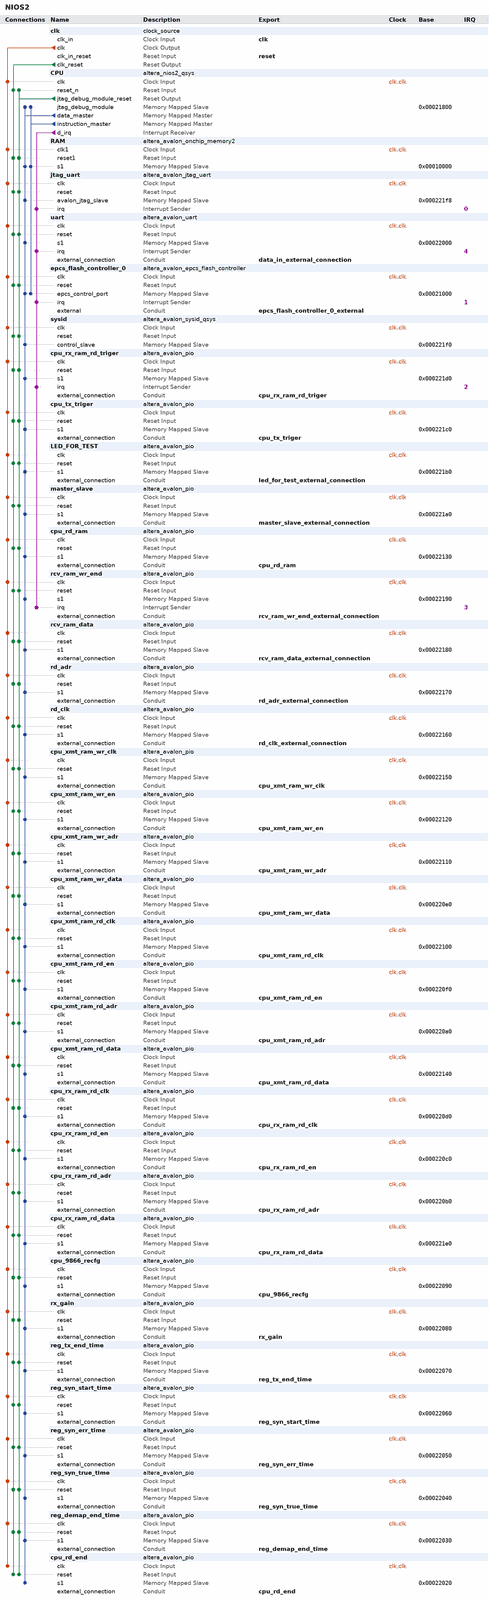
[diagram p0: system contents, whole]
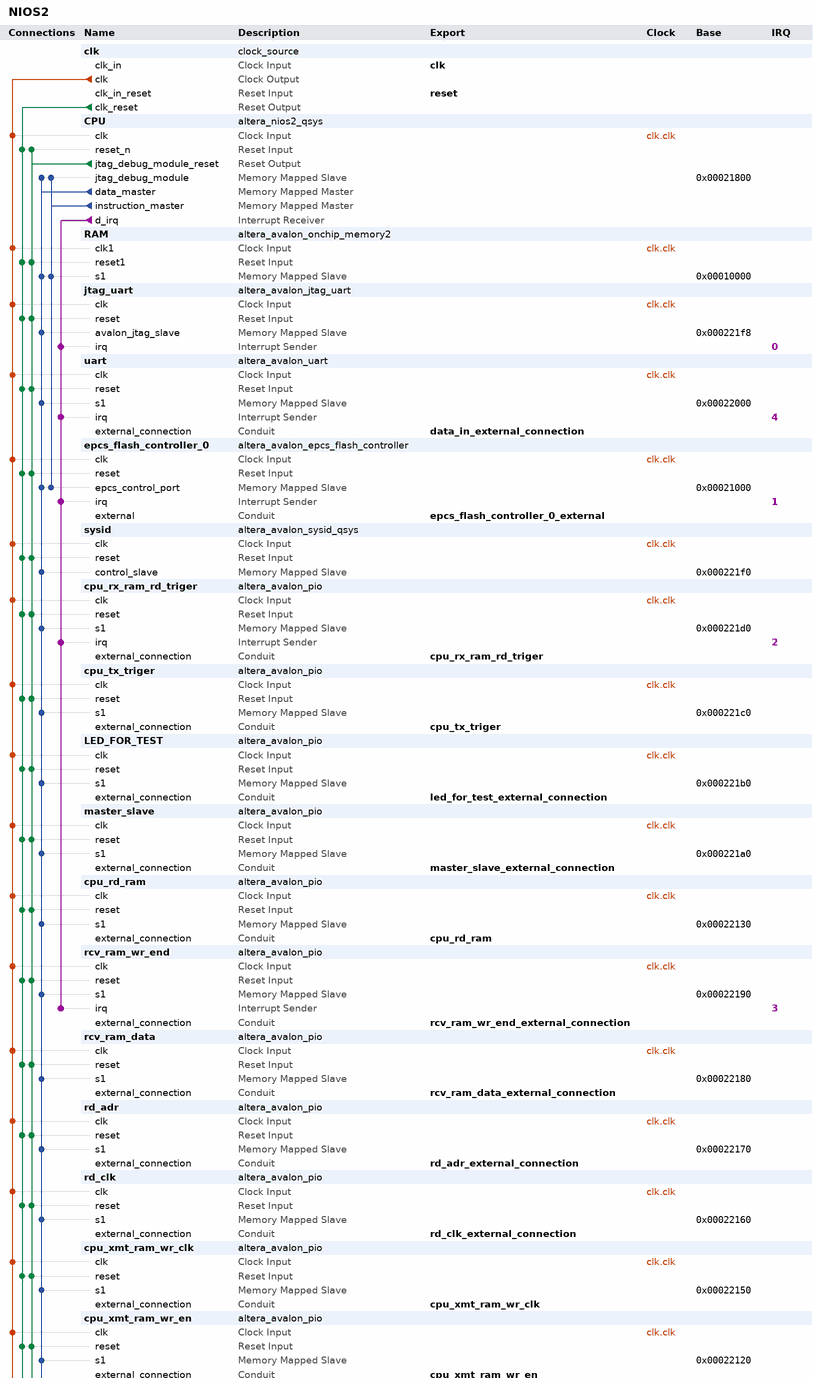
[diagram p1: system contents, upper part]
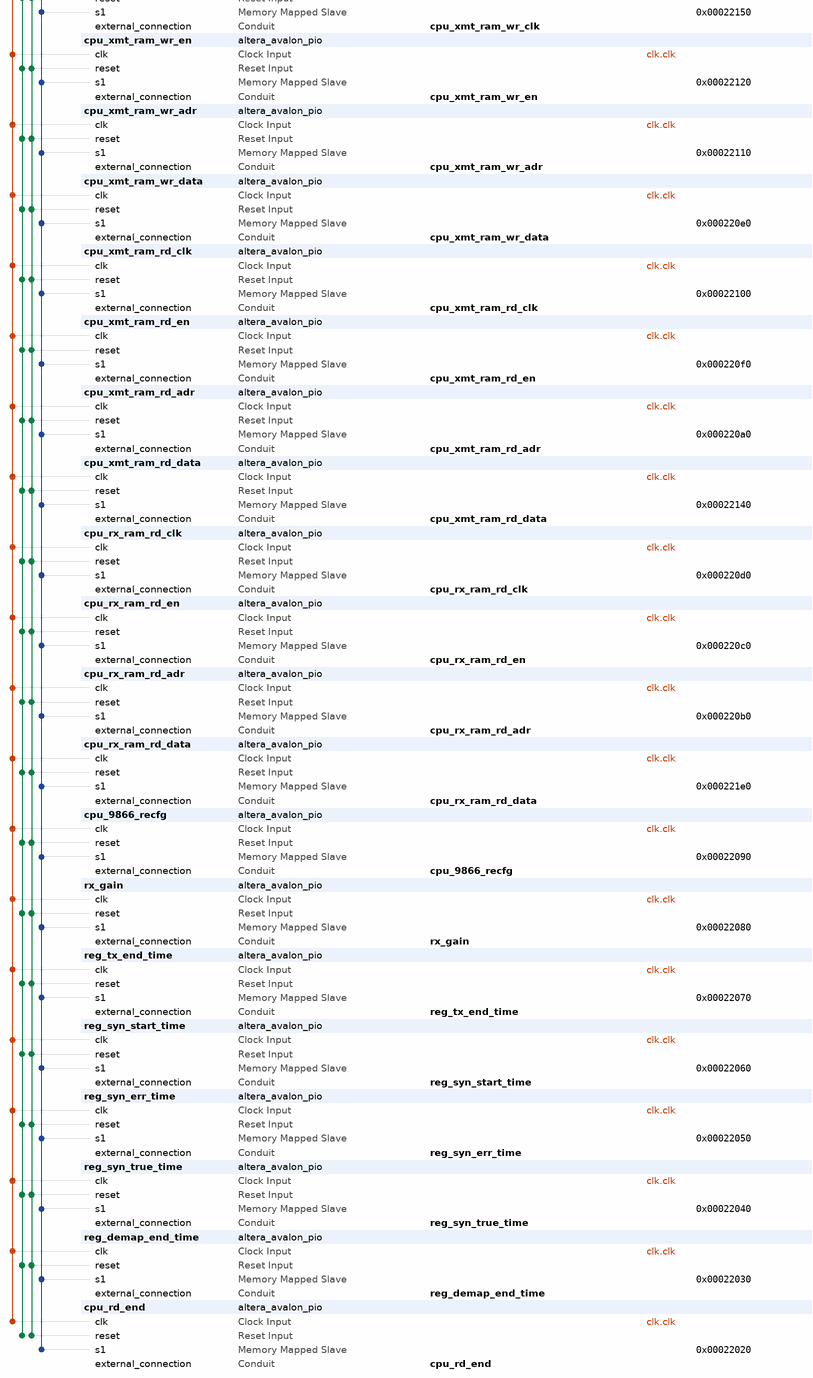
[diagram p2: system contents, lower part]
# Platform Designer (Qsys) system NIOS2, Cyclone IV E EP4CE115F29C7
# Parameters at their usual value, and those the tool derives, are not listed.
package require -exact qsys 12.1
create_system NIOS2
set_project_property DEVICE_FAMILY {Cyclone IV E}
set_project_property DEVICE EP4CE115F29C7

add_instance clk clock_source 12.1
set_instance_parameter_value clk clockFrequency 25000000

add_instance CPU altera_nios2_qsys 12.1
set_instance_parameter_value CPU resetSlave epcs_flash_controller_0.epcs_control_port
set_instance_parameter_value CPU exceptionSlave RAM.s1
set_instance_parameter_value CPU breakSlave CPU.jtag_debug_module
set_instance_parameter_value CPU impl Fast
set_instance_parameter_value CPU icache_size 4096

add_instance RAM altera_avalon_onchip_memory2 12.1
set_instance_parameter_value RAM dataWidth 32
set_instance_parameter_value RAM dualPort false
set_instance_parameter_value RAM initMemContent true
set_instance_parameter_value RAM initializationFileName RAM
set_instance_parameter_value RAM memorySize 51200

add_instance jtag_uart altera_avalon_jtag_uart 12.1
set_instance_parameter_value jtag_uart simInteractiveOptions INTERACTIVE_ASCII_OUTPUT

add_instance uart altera_avalon_uart 12.1
set_instance_parameter_value uart baud 115200
set_instance_parameter_value uart dataBits 8
set_instance_parameter_value uart fixedBaud true
set_instance_parameter_value uart parity NONE
set_instance_parameter_value uart stopBits 1

add_instance epcs_flash_controller_0 altera_avalon_epcs_flash_controller 12.1

add_instance sysid altera_avalon_sysid_qsys 12.1
set_instance_parameter_value sysid id 1

add_instance cpu_rx_ram_rd_triger altera_avalon_pio 12.1
set_instance_parameter_value cpu_rx_ram_rd_triger captureEdge true
set_instance_parameter_value cpu_rx_ram_rd_triger direction Input
set_instance_parameter_value cpu_rx_ram_rd_triger generateIRQ true
set_instance_parameter_value cpu_rx_ram_rd_triger irqType EDGE
set_instance_parameter_value cpu_rx_ram_rd_triger width 1

add_instance cpu_tx_triger altera_avalon_pio 12.1
set_instance_parameter_value cpu_tx_triger direction Output
set_instance_parameter_value cpu_tx_triger width 1

add_instance LED_FOR_TEST altera_avalon_pio 12.1
set_instance_parameter_value LED_FOR_TEST direction Output
set_instance_parameter_value LED_FOR_TEST width 1

add_instance master_slave altera_avalon_pio 12.1
set_instance_parameter_value master_slave direction Output
set_instance_parameter_value master_slave width 1

add_instance cpu_rd_ram altera_avalon_pio 12.1
set_instance_parameter_value cpu_rd_ram direction Output
set_instance_parameter_value cpu_rd_ram width 1

add_instance rcv_ram_wr_end altera_avalon_pio 12.1
set_instance_parameter_value rcv_ram_wr_end captureEdge true
set_instance_parameter_value rcv_ram_wr_end direction Input
set_instance_parameter_value rcv_ram_wr_end generateIRQ true
set_instance_parameter_value rcv_ram_wr_end irqType EDGE
set_instance_parameter_value rcv_ram_wr_end width 1

add_instance rcv_ram_data altera_avalon_pio 12.1
set_instance_parameter_value rcv_ram_data direction Input
set_instance_parameter_value rcv_ram_data width 16

add_instance rd_adr altera_avalon_pio 12.1
set_instance_parameter_value rd_adr direction Output
set_instance_parameter_value rd_adr width 10

add_instance rd_clk altera_avalon_pio 12.1
set_instance_parameter_value rd_clk direction Output
set_instance_parameter_value rd_clk width 1

add_instance cpu_xmt_ram_wr_clk altera_avalon_pio 12.1
set_instance_parameter_value cpu_xmt_ram_wr_clk direction Output
set_instance_parameter_value cpu_xmt_ram_wr_clk width 1

add_instance cpu_xmt_ram_wr_en altera_avalon_pio 12.1
set_instance_parameter_value cpu_xmt_ram_wr_en direction Output
set_instance_parameter_value cpu_xmt_ram_wr_en width 1

add_instance cpu_xmt_ram_wr_adr altera_avalon_pio 12.1
set_instance_parameter_value cpu_xmt_ram_wr_adr direction Output
set_instance_parameter_value cpu_xmt_ram_wr_adr width 7

add_instance cpu_xmt_ram_wr_data altera_avalon_pio 12.1
set_instance_parameter_value cpu_xmt_ram_wr_data direction Output
set_instance_parameter_value cpu_xmt_ram_wr_data width 32

add_instance cpu_xmt_ram_rd_clk altera_avalon_pio 12.1
set_instance_parameter_value cpu_xmt_ram_rd_clk direction Output
set_instance_parameter_value cpu_xmt_ram_rd_clk width 1

add_instance cpu_xmt_ram_rd_en altera_avalon_pio 12.1
set_instance_parameter_value cpu_xmt_ram_rd_en direction Output
set_instance_parameter_value cpu_xmt_ram_rd_en width 1

add_instance cpu_xmt_ram_rd_adr altera_avalon_pio 12.1
set_instance_parameter_value cpu_xmt_ram_rd_adr direction Output
set_instance_parameter_value cpu_xmt_ram_rd_adr width 7

add_instance cpu_xmt_ram_rd_data altera_avalon_pio 12.1
set_instance_parameter_value cpu_xmt_ram_rd_data direction Input
set_instance_parameter_value cpu_xmt_ram_rd_data width 32

add_instance cpu_rx_ram_rd_clk altera_avalon_pio 12.1
set_instance_parameter_value cpu_rx_ram_rd_clk direction Output
set_instance_parameter_value cpu_rx_ram_rd_clk width 1

add_instance cpu_rx_ram_rd_en altera_avalon_pio 12.1
set_instance_parameter_value cpu_rx_ram_rd_en direction Output
set_instance_parameter_value cpu_rx_ram_rd_en width 1

add_instance cpu_rx_ram_rd_adr altera_avalon_pio 12.1
set_instance_parameter_value cpu_rx_ram_rd_adr direction Output
set_instance_parameter_value cpu_rx_ram_rd_adr width 7

add_instance cpu_rx_ram_rd_data altera_avalon_pio 12.1
set_instance_parameter_value cpu_rx_ram_rd_data direction Input
set_instance_parameter_value cpu_rx_ram_rd_data width 32

add_instance cpu_9866_recfg altera_avalon_pio 12.1
set_instance_parameter_value cpu_9866_recfg direction Output
set_instance_parameter_value cpu_9866_recfg width 1

add_instance rx_gain altera_avalon_pio 12.1
set_instance_parameter_value rx_gain direction Output
set_instance_parameter_value rx_gain width 6

add_instance reg_tx_end_time altera_avalon_pio 12.1
set_instance_parameter_value reg_tx_end_time direction Input
set_instance_parameter_value reg_tx_end_time width 32

add_instance reg_syn_start_time altera_avalon_pio 12.1
set_instance_parameter_value reg_syn_start_time direction Input
set_instance_parameter_value reg_syn_start_time width 32

add_instance reg_syn_err_time altera_avalon_pio 12.1
set_instance_parameter_value reg_syn_err_time direction Input
set_instance_parameter_value reg_syn_err_time width 32

add_instance reg_syn_true_time altera_avalon_pio 12.1
set_instance_parameter_value reg_syn_true_time direction Input
set_instance_parameter_value reg_syn_true_time width 32

add_instance reg_demap_end_time altera_avalon_pio 12.1
set_instance_parameter_value reg_demap_end_time direction Input
set_instance_parameter_value reg_demap_end_time width 32

add_instance cpu_rd_end altera_avalon_pio 12.1
set_instance_parameter_value cpu_rd_end direction Output
set_instance_parameter_value cpu_rd_end width 1

# connections
add_connection clk.clk CPU.clk clock
add_connection clk.clk cpu_9866_recfg.clk clock
add_connection clk.clk cpu_rd_end.clk clock
add_connection clk.clk cpu_rd_ram.clk clock
add_connection clk.clk cpu_rx_ram_rd_adr.clk clock
add_connection clk.clk cpu_rx_ram_rd_clk.clk clock
add_connection clk.clk cpu_rx_ram_rd_data.clk clock
add_connection clk.clk cpu_rx_ram_rd_en.clk clock
add_connection clk.clk cpu_rx_ram_rd_triger.clk clock
add_connection clk.clk cpu_tx_triger.clk clock
add_connection clk.clk cpu_xmt_ram_rd_adr.clk clock
add_connection clk.clk cpu_xmt_ram_rd_clk.clk clock
add_connection clk.clk cpu_xmt_ram_rd_data.clk clock
add_connection clk.clk cpu_xmt_ram_rd_en.clk clock
add_connection clk.clk cpu_xmt_ram_wr_adr.clk clock
add_connection clk.clk cpu_xmt_ram_wr_clk.clk clock
add_connection clk.clk cpu_xmt_ram_wr_data.clk clock
add_connection clk.clk cpu_xmt_ram_wr_en.clk clock
add_connection clk.clk epcs_flash_controller_0.clk clock
add_connection clk.clk jtag_uart.clk clock
add_connection clk.clk LED_FOR_TEST.clk clock
add_connection clk.clk master_slave.clk clock
add_connection clk.clk RAM.clk1 clock
add_connection clk.clk rcv_ram_data.clk clock
add_connection clk.clk rcv_ram_wr_end.clk clock
add_connection clk.clk rd_adr.clk clock
add_connection clk.clk rd_clk.clk clock
add_connection clk.clk reg_demap_end_time.clk clock
add_connection clk.clk reg_syn_err_time.clk clock
add_connection clk.clk reg_syn_start_time.clk clock
add_connection clk.clk reg_syn_true_time.clk clock
add_connection clk.clk reg_tx_end_time.clk clock
add_connection clk.clk rx_gain.clk clock
add_connection clk.clk sysid.clk clock
add_connection clk.clk uart.clk clock
add_connection clk.clk_reset CPU.reset_n reset
add_connection clk.clk_reset cpu_9866_recfg.reset reset
add_connection clk.clk_reset cpu_rd_end.reset reset
add_connection clk.clk_reset cpu_rd_ram.reset reset
add_connection clk.clk_reset cpu_rx_ram_rd_adr.reset reset
add_connection clk.clk_reset cpu_rx_ram_rd_clk.reset reset
add_connection clk.clk_reset cpu_rx_ram_rd_data.reset reset
add_connection clk.clk_reset cpu_rx_ram_rd_en.reset reset
add_connection clk.clk_reset cpu_rx_ram_rd_triger.reset reset
add_connection clk.clk_reset cpu_tx_triger.reset reset
add_connection clk.clk_reset cpu_xmt_ram_rd_adr.reset reset
add_connection clk.clk_reset cpu_xmt_ram_rd_clk.reset reset
add_connection clk.clk_reset cpu_xmt_ram_rd_data.reset reset
add_connection clk.clk_reset cpu_xmt_ram_rd_en.reset reset
add_connection clk.clk_reset cpu_xmt_ram_wr_adr.reset reset
add_connection clk.clk_reset cpu_xmt_ram_wr_clk.reset reset
add_connection clk.clk_reset cpu_xmt_ram_wr_data.reset reset
add_connection clk.clk_reset cpu_xmt_ram_wr_en.reset reset
add_connection clk.clk_reset epcs_flash_controller_0.reset reset
add_connection clk.clk_reset jtag_uart.reset reset
add_connection clk.clk_reset LED_FOR_TEST.reset reset
add_connection clk.clk_reset master_slave.reset reset
add_connection clk.clk_reset RAM.reset1 reset
add_connection clk.clk_reset rcv_ram_data.reset reset
add_connection clk.clk_reset rcv_ram_wr_end.reset reset
add_connection clk.clk_reset rd_adr.reset reset
add_connection clk.clk_reset rd_clk.reset reset
add_connection clk.clk_reset reg_demap_end_time.reset reset
add_connection clk.clk_reset reg_syn_err_time.reset reset
add_connection clk.clk_reset reg_syn_start_time.reset reset
add_connection clk.clk_reset reg_syn_true_time.reset reset
add_connection clk.clk_reset reg_tx_end_time.reset reset
add_connection clk.clk_reset rx_gain.reset reset
add_connection clk.clk_reset sysid.reset reset
add_connection clk.clk_reset uart.reset reset
add_connection CPU.jtag_debug_module_reset CPU.reset_n reset
add_connection CPU.jtag_debug_module_reset cpu_9866_recfg.reset reset
add_connection CPU.jtag_debug_module_reset cpu_rd_end.reset reset
add_connection CPU.jtag_debug_module_reset cpu_rd_ram.reset reset
add_connection CPU.jtag_debug_module_reset cpu_rx_ram_rd_adr.reset reset
add_connection CPU.jtag_debug_module_reset cpu_rx_ram_rd_clk.reset reset
add_connection CPU.jtag_debug_module_reset cpu_rx_ram_rd_data.reset reset
add_connection CPU.jtag_debug_module_reset cpu_rx_ram_rd_en.reset reset
add_connection CPU.jtag_debug_module_reset cpu_rx_ram_rd_triger.reset reset
add_connection CPU.jtag_debug_module_reset cpu_tx_triger.reset reset
add_connection CPU.jtag_debug_module_reset cpu_xmt_ram_rd_adr.reset reset
add_connection CPU.jtag_debug_module_reset cpu_xmt_ram_rd_clk.reset reset
add_connection CPU.jtag_debug_module_reset cpu_xmt_ram_rd_data.reset reset
add_connection CPU.jtag_debug_module_reset cpu_xmt_ram_rd_en.reset reset
add_connection CPU.jtag_debug_module_reset cpu_xmt_ram_wr_adr.reset reset
add_connection CPU.jtag_debug_module_reset cpu_xmt_ram_wr_clk.reset reset
add_connection CPU.jtag_debug_module_reset cpu_xmt_ram_wr_data.reset reset
add_connection CPU.jtag_debug_module_reset cpu_xmt_ram_wr_en.reset reset
add_connection CPU.jtag_debug_module_reset epcs_flash_controller_0.reset reset
add_connection CPU.jtag_debug_module_reset jtag_uart.reset reset
add_connection CPU.jtag_debug_module_reset LED_FOR_TEST.reset reset
add_connection CPU.jtag_debug_module_reset master_slave.reset reset
add_connection CPU.jtag_debug_module_reset RAM.reset1 reset
add_connection CPU.jtag_debug_module_reset rcv_ram_data.reset reset
add_connection CPU.jtag_debug_module_reset rcv_ram_wr_end.reset reset
add_connection CPU.jtag_debug_module_reset rd_adr.reset reset
add_connection CPU.jtag_debug_module_reset rd_clk.reset reset
add_connection CPU.jtag_debug_module_reset reg_demap_end_time.reset reset
add_connection CPU.jtag_debug_module_reset reg_syn_err_time.reset reset
add_connection CPU.jtag_debug_module_reset reg_syn_start_time.reset reset
add_connection CPU.jtag_debug_module_reset reg_syn_true_time.reset reset
add_connection CPU.jtag_debug_module_reset reg_tx_end_time.reset reset
add_connection CPU.jtag_debug_module_reset rx_gain.reset reset
add_connection CPU.jtag_debug_module_reset sysid.reset reset
add_connection CPU.jtag_debug_module_reset uart.reset reset
add_connection CPU.data_master CPU.jtag_debug_module avalon
set_connection_parameter_value CPU.data_master/CPU.jtag_debug_module baseAddress 0x00021800
add_connection CPU.data_master cpu_9866_recfg.s1 avalon
set_connection_parameter_value CPU.data_master/cpu_9866_recfg.s1 baseAddress 0x00022090
add_connection CPU.data_master cpu_rd_end.s1 avalon
set_connection_parameter_value CPU.data_master/cpu_rd_end.s1 baseAddress 0x00022020
add_connection CPU.data_master cpu_rd_ram.s1 avalon
set_connection_parameter_value CPU.data_master/cpu_rd_ram.s1 baseAddress 0x00022130
add_connection CPU.data_master cpu_rx_ram_rd_adr.s1 avalon
set_connection_parameter_value CPU.data_master/cpu_rx_ram_rd_adr.s1 baseAddress 0x000220b0
add_connection CPU.data_master cpu_rx_ram_rd_clk.s1 avalon
set_connection_parameter_value CPU.data_master/cpu_rx_ram_rd_clk.s1 baseAddress 0x000220d0
add_connection CPU.data_master cpu_rx_ram_rd_data.s1 avalon
set_connection_parameter_value CPU.data_master/cpu_rx_ram_rd_data.s1 baseAddress 0x000221e0
add_connection CPU.data_master cpu_rx_ram_rd_en.s1 avalon
set_connection_parameter_value CPU.data_master/cpu_rx_ram_rd_en.s1 baseAddress 0x000220c0
add_connection CPU.data_master cpu_rx_ram_rd_triger.s1 avalon
set_connection_parameter_value CPU.data_master/cpu_rx_ram_rd_triger.s1 baseAddress 0x000221d0
add_connection CPU.data_master cpu_tx_triger.s1 avalon
set_connection_parameter_value CPU.data_master/cpu_tx_triger.s1 baseAddress 0x000221c0
add_connection CPU.data_master cpu_xmt_ram_rd_adr.s1 avalon
set_connection_parameter_value CPU.data_master/cpu_xmt_ram_rd_adr.s1 baseAddress 0x000220a0
add_connection CPU.data_master cpu_xmt_ram_rd_clk.s1 avalon
set_connection_parameter_value CPU.data_master/cpu_xmt_ram_rd_clk.s1 baseAddress 0x00022100
add_connection CPU.data_master cpu_xmt_ram_rd_data.s1 avalon
set_connection_parameter_value CPU.data_master/cpu_xmt_ram_rd_data.s1 baseAddress 0x00022140
add_connection CPU.data_master cpu_xmt_ram_rd_en.s1 avalon
set_connection_parameter_value CPU.data_master/cpu_xmt_ram_rd_en.s1 baseAddress 0x000220f0
add_connection CPU.data_master cpu_xmt_ram_wr_adr.s1 avalon
set_connection_parameter_value CPU.data_master/cpu_xmt_ram_wr_adr.s1 baseAddress 0x00022110
add_connection CPU.data_master cpu_xmt_ram_wr_clk.s1 avalon
set_connection_parameter_value CPU.data_master/cpu_xmt_ram_wr_clk.s1 baseAddress 0x00022150
add_connection CPU.data_master cpu_xmt_ram_wr_data.s1 avalon
set_connection_parameter_value CPU.data_master/cpu_xmt_ram_wr_data.s1 baseAddress 0x000220e0
add_connection CPU.data_master cpu_xmt_ram_wr_en.s1 avalon
set_connection_parameter_value CPU.data_master/cpu_xmt_ram_wr_en.s1 baseAddress 0x00022120
add_connection CPU.data_master epcs_flash_controller_0.epcs_control_port avalon
set_connection_parameter_value CPU.data_master/epcs_flash_controller_0.epcs_control_port baseAddress 0x00021000
add_connection CPU.data_master jtag_uart.avalon_jtag_slave avalon
set_connection_parameter_value CPU.data_master/jtag_uart.avalon_jtag_slave baseAddress 0x000221f8
add_connection CPU.data_master LED_FOR_TEST.s1 avalon
set_connection_parameter_value CPU.data_master/LED_FOR_TEST.s1 baseAddress 0x000221b0
add_connection CPU.data_master master_slave.s1 avalon
set_connection_parameter_value CPU.data_master/master_slave.s1 baseAddress 0x000221a0
add_connection CPU.data_master RAM.s1 avalon
set_connection_parameter_value CPU.data_master/RAM.s1 baseAddress 0x00010000
add_connection CPU.data_master rcv_ram_data.s1 avalon
set_connection_parameter_value CPU.data_master/rcv_ram_data.s1 baseAddress 0x00022180
add_connection CPU.data_master rcv_ram_wr_end.s1 avalon
set_connection_parameter_value CPU.data_master/rcv_ram_wr_end.s1 baseAddress 0x00022190
add_connection CPU.data_master rd_adr.s1 avalon
set_connection_parameter_value CPU.data_master/rd_adr.s1 baseAddress 0x00022170
add_connection CPU.data_master rd_clk.s1 avalon
set_connection_parameter_value CPU.data_master/rd_clk.s1 baseAddress 0x00022160
add_connection CPU.data_master reg_demap_end_time.s1 avalon
set_connection_parameter_value CPU.data_master/reg_demap_end_time.s1 baseAddress 0x00022030
add_connection CPU.data_master reg_syn_err_time.s1 avalon
set_connection_parameter_value CPU.data_master/reg_syn_err_time.s1 baseAddress 0x00022050
add_connection CPU.data_master reg_syn_start_time.s1 avalon
set_connection_parameter_value CPU.data_master/reg_syn_start_time.s1 baseAddress 0x00022060
add_connection CPU.data_master reg_syn_true_time.s1 avalon
set_connection_parameter_value CPU.data_master/reg_syn_true_time.s1 baseAddress 0x00022040
add_connection CPU.data_master reg_tx_end_time.s1 avalon
set_connection_parameter_value CPU.data_master/reg_tx_end_time.s1 baseAddress 0x00022070
add_connection CPU.data_master rx_gain.s1 avalon
set_connection_parameter_value CPU.data_master/rx_gain.s1 baseAddress 0x00022080
add_connection CPU.data_master sysid.control_slave avalon
set_connection_parameter_value CPU.data_master/sysid.control_slave baseAddress 0x000221f0
add_connection CPU.data_master uart.s1 avalon
set_connection_parameter_value CPU.data_master/uart.s1 baseAddress 0x00022000
add_connection CPU.instruction_master CPU.jtag_debug_module avalon
set_connection_parameter_value CPU.instruction_master/CPU.jtag_debug_module baseAddress 0x00021800
add_connection CPU.instruction_master epcs_flash_controller_0.epcs_control_port avalon
set_connection_parameter_value CPU.instruction_master/epcs_flash_controller_0.epcs_control_port baseAddress 0x00021000
add_connection CPU.instruction_master RAM.s1 avalon
set_connection_parameter_value CPU.instruction_master/RAM.s1 baseAddress 0x00010000
add_connection CPU.d_irq cpu_rx_ram_rd_triger.irq interrupt
set_connection_parameter_value CPU.d_irq/cpu_rx_ram_rd_triger.irq irqNumber 2
add_connection CPU.d_irq epcs_flash_controller_0.irq interrupt
set_connection_parameter_value CPU.d_irq/epcs_flash_controller_0.irq irqNumber 1
add_connection CPU.d_irq jtag_uart.irq interrupt
set_connection_parameter_value CPU.d_irq/jtag_uart.irq irqNumber 0
add_connection CPU.d_irq rcv_ram_wr_end.irq interrupt
set_connection_parameter_value CPU.d_irq/rcv_ram_wr_end.irq irqNumber 3
add_connection CPU.d_irq uart.irq interrupt
set_connection_parameter_value CPU.d_irq/uart.irq irqNumber 4

# exported interfaces
add_interface clk clock sink
set_interface_property clk EXPORT_OF clk.clk_in
add_interface reset reset sink
set_interface_property reset EXPORT_OF clk.clk_in_reset
add_interface data_in_external_connection conduit end
set_interface_property data_in_external_connection EXPORT_OF uart.external_connection
add_interface epcs_flash_controller_0_external conduit end
set_interface_property epcs_flash_controller_0_external EXPORT_OF epcs_flash_controller_0.external
add_interface cpu_rx_ram_rd_data conduit end
set_interface_property cpu_rx_ram_rd_data EXPORT_OF cpu_rx_ram_rd_data.external_connection
add_interface cpu_rx_ram_rd_triger conduit end
set_interface_property cpu_rx_ram_rd_triger EXPORT_OF cpu_rx_ram_rd_triger.external_connection
add_interface cpu_tx_triger conduit end
set_interface_property cpu_tx_triger EXPORT_OF cpu_tx_triger.external_connection
add_interface led_for_test_external_connection conduit end
set_interface_property led_for_test_external_connection EXPORT_OF LED_FOR_TEST.external_connection
add_interface master_slave_external_connection conduit end
set_interface_property master_slave_external_connection EXPORT_OF master_slave.external_connection
add_interface rcv_ram_wr_end_external_connection conduit end
set_interface_property rcv_ram_wr_end_external_connection EXPORT_OF rcv_ram_wr_end.external_connection
add_interface rcv_ram_data_external_connection conduit end
set_interface_property rcv_ram_data_external_connection EXPORT_OF rcv_ram_data.external_connection
add_interface rd_adr_external_connection conduit end
set_interface_property rd_adr_external_connection EXPORT_OF rd_adr.external_connection
add_interface rd_clk_external_connection conduit end
set_interface_property rd_clk_external_connection EXPORT_OF rd_clk.external_connection
add_interface cpu_xmt_ram_wr_clk conduit end
set_interface_property cpu_xmt_ram_wr_clk EXPORT_OF cpu_xmt_ram_wr_clk.external_connection
add_interface cpu_rd_ram conduit end
set_interface_property cpu_rd_ram EXPORT_OF cpu_rd_ram.external_connection
add_interface cpu_xmt_ram_wr_en conduit end
set_interface_property cpu_xmt_ram_wr_en EXPORT_OF cpu_xmt_ram_wr_en.external_connection
add_interface cpu_xmt_ram_wr_adr conduit end
set_interface_property cpu_xmt_ram_wr_adr EXPORT_OF cpu_xmt_ram_wr_adr.external_connection
add_interface cpu_xmt_ram_rd_clk conduit end
set_interface_property cpu_xmt_ram_rd_clk EXPORT_OF cpu_xmt_ram_rd_clk.external_connection
add_interface cpu_xmt_ram_rd_en conduit end
set_interface_property cpu_xmt_ram_rd_en EXPORT_OF cpu_xmt_ram_rd_en.external_connection
add_interface cpu_xmt_ram_rd_adr conduit end
set_interface_property cpu_xmt_ram_rd_adr EXPORT_OF cpu_xmt_ram_rd_adr.external_connection
add_interface cpu_rx_ram_rd_clk conduit end
set_interface_property cpu_rx_ram_rd_clk EXPORT_OF cpu_rx_ram_rd_clk.external_connection
add_interface cpu_rx_ram_rd_en conduit end
set_interface_property cpu_rx_ram_rd_en EXPORT_OF cpu_rx_ram_rd_en.external_connection
add_interface cpu_rx_ram_rd_adr conduit end
set_interface_property cpu_rx_ram_rd_adr EXPORT_OF cpu_rx_ram_rd_adr.external_connection
add_interface cpu_xmt_ram_rd_data conduit end
set_interface_property cpu_xmt_ram_rd_data EXPORT_OF cpu_xmt_ram_rd_data.external_connection
add_interface cpu_xmt_ram_wr_data conduit end
set_interface_property cpu_xmt_ram_wr_data EXPORT_OF cpu_xmt_ram_wr_data.external_connection
add_interface cpu_9866_recfg conduit end
set_interface_property cpu_9866_recfg EXPORT_OF cpu_9866_recfg.external_connection
add_interface rx_gain conduit end
set_interface_property rx_gain EXPORT_OF rx_gain.external_connection
add_interface reg_tx_end_time conduit end
set_interface_property reg_tx_end_time EXPORT_OF reg_tx_end_time.external_connection
add_interface reg_syn_start_time conduit end
set_interface_property reg_syn_start_time EXPORT_OF reg_syn_start_time.external_connection
add_interface reg_syn_err_time conduit end
set_interface_property reg_syn_err_time EXPORT_OF reg_syn_err_time.external_connection
add_interface reg_syn_true_time conduit end
set_interface_property reg_syn_true_time EXPORT_OF reg_syn_true_time.external_connection
add_interface reg_demap_end_time conduit end
set_interface_property reg_demap_end_time EXPORT_OF reg_demap_end_time.external_connection
add_interface cpu_rd_end conduit end
set_interface_property cpu_rd_end EXPORT_OF cpu_rd_end.external_connection

save_system NIOS2.qsys
